# EasyEDA schematic I-Ching connection board v4 EASYEDA.json
TITLE: I-Ching connection board circuit; REV: v4; Date: 2020-09-13; Sheet: 1/1; Drawn By: Ferrie Bank; Company: Oude Snepelaar
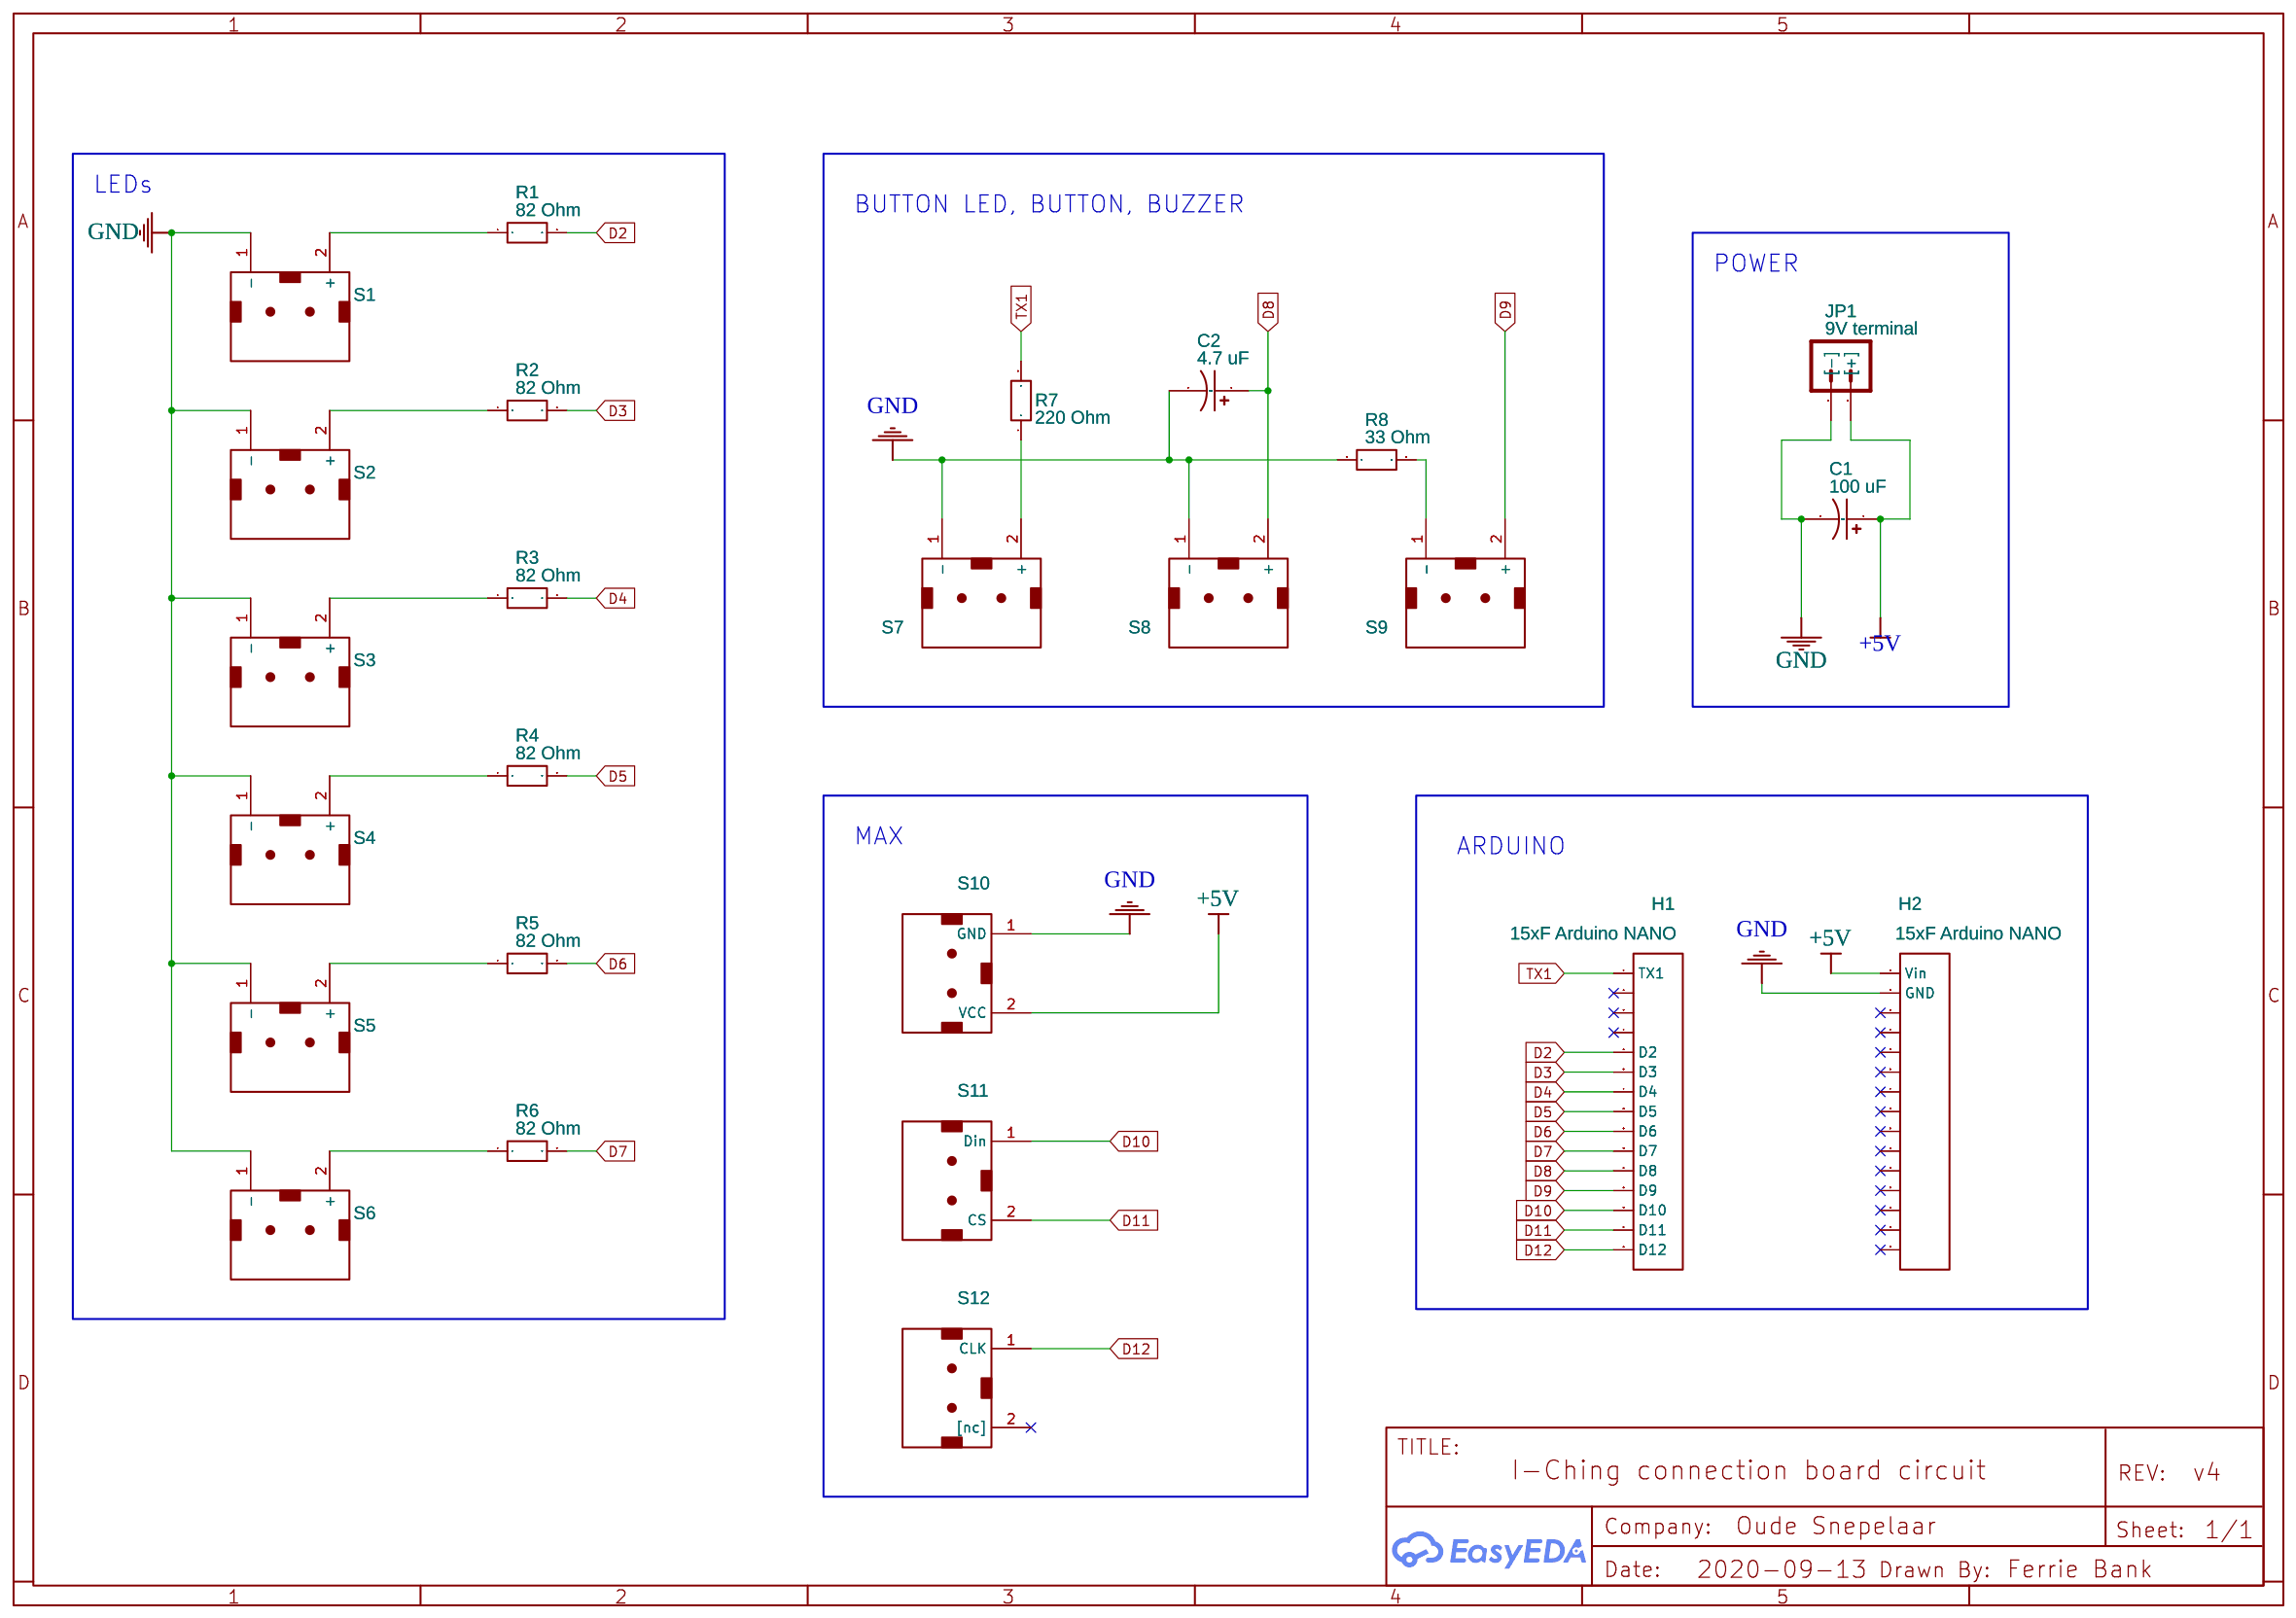
[diagram p0: schematic sheet]

## Parts
C1  100 uF  [CAP-D6.3×F2.5]
C2  4.7 uF  [CAP-D6.3×F2.5]
H1  15xF Arduino NANO  [HDR-TH_15P-P2.54-V]
H2  15xF Arduino NANO  [HDR-TH_15P-P2.54-V]
JP1  9V terminal  [SCREWTERMINAL-5MM-2-DW]
R1  82 Ohm  [R_AXIAL-0.5]
R2  82 Ohm  [R_AXIAL-0.5]
R3  82 Ohm  [R_AXIAL-0.5]
R4  82 Ohm  [R_AXIAL-0.5]
R5  82 Ohm  [R_AXIAL-0.5]
R6  82 Ohm  [R_AXIAL-0.5]
R7  220 Ohm  [R_AXIAL-0.5]
R8  33 Ohm  [R_AXIAL-0.5]
S1  JST 2.0 6mm x 4.5mm  [JST 2.0 4.5 X 6.0 MM]
S2  JST 2.0 6mm x 4.5mm  [JST 2.0 4.5 X 6.0 MM]
S3  JST 2.0 6mm x 4.5mm  [JST 2.0 4.5 X 6.0 MM]
S4  JST 2.0 6mm x 4.5mm  [JST 2.0 4.5 X 6.0 MM]
S5  JST 2.0 6mm x 4.5mm  [JST 2.0 4.5 X 6.0 MM]
S6  JST 2.0 6mm x 4.5mm  [JST 2.0 4.5 X 6.0 MM]
S7  JST 2.0 6mm x 4.5mm  [JST 2.0 4.5 X 6.0 MM]
S8  JST 2.0 6mm x 4.5mm  [JST 2.0 4.5 X 6.0 MM]
S9  JST 2.0 6mm x 4.5mm  [JST 2.0 4.5 X 6.0 MM]
S10  JST 2.0 6mm x 4.5mm  [JST 2.0 4.5 X 6.0 MM]
S11  JST 2.0 6mm x 4.5mm  [JST 2.0 4.5 X 6.0 MM]
S12  JST 2.0 6mm x 4.5mm  [JST 2.0 4.5 X 6.0 MM]

## Library data of the parts
C1 C2 = CE_TH_D10.0×F5.0_US: Contributor: LCEDA_Lib
H1 H2 = Header-Female-2.54_1x15: Supplier: LCSC; Manufacturer: Ckmtw; Manufacturer Part: 220S-1*15P H=8.5MM Ytype Gold-plated; Supplier Part: C124408
JP1 = Screw Terminal 2-Pin (5mm Pitch): Contributor: SparkFun; Package Display: No
R1-R8 = R_0201_EU: Contributor: LCEDA_Lib
S1-S12 = JST 2.0 6mm x 4.5mm: Contributor: ferrie.bank

## Nets
+5V: C1.1 H2.1(Vin) JP1.2([+]) S10.2(VCC)
GND: C1.2 C2.2 H2.2(GND) JP1.1([-]) R8.1 S1.1(-) S2.1(-) S3.1(-) S4.1(-) S5.1(-) S6.1(-) S7.1(-) S8.1(-) S10.1(GND)
D2: H1.5(D2) R1.2
D3: H1.6(D3) R2.2
D4: H1.7(D4) R3.2
D5: H1.8(D5) R4.2
D6: H1.9(D6) R5.2
D7: H1.10(D7) R6.2
D8: C2.1 H1.11(D8) S8.2(+)
D9: H1.12(D9) S9.2(+)
D10: H1.13(D10) S11.1(Din)
D11: H1.14(D11) S11.2(CS)
D12: H1.15(D12) S12.1(CLK)
TX1: H1.1(TX1) R7.2
Net-(R1-1): R1.1 S1.2(+)
Net-(R2-1): R2.1 S2.2(+)
Net-(R3-1): R3.1 S3.2(+)
Net-(R4-1): R4.1 S4.2(+)
Net-(R5-1): R5.1 S5.2(+)
Net-(R6-1): R6.1 S6.2(+)
Net-(R7-1): R7.1 S7.2(+)
Net-(R8-2): R8.2 S9.1(-)

Not connected (* = marked no-connect by the designer): H1 2* 3* 4*; H2 3* 4* 5* 6* 7* 8* 9* 10* 11* 12* 13* 14* 15*; S12 2([nc])*

## Notes on the sheet
- LEDs
- BUTTON LED, BUTTON, BUZZER
- POWER
- MAX
- ARDUINO
